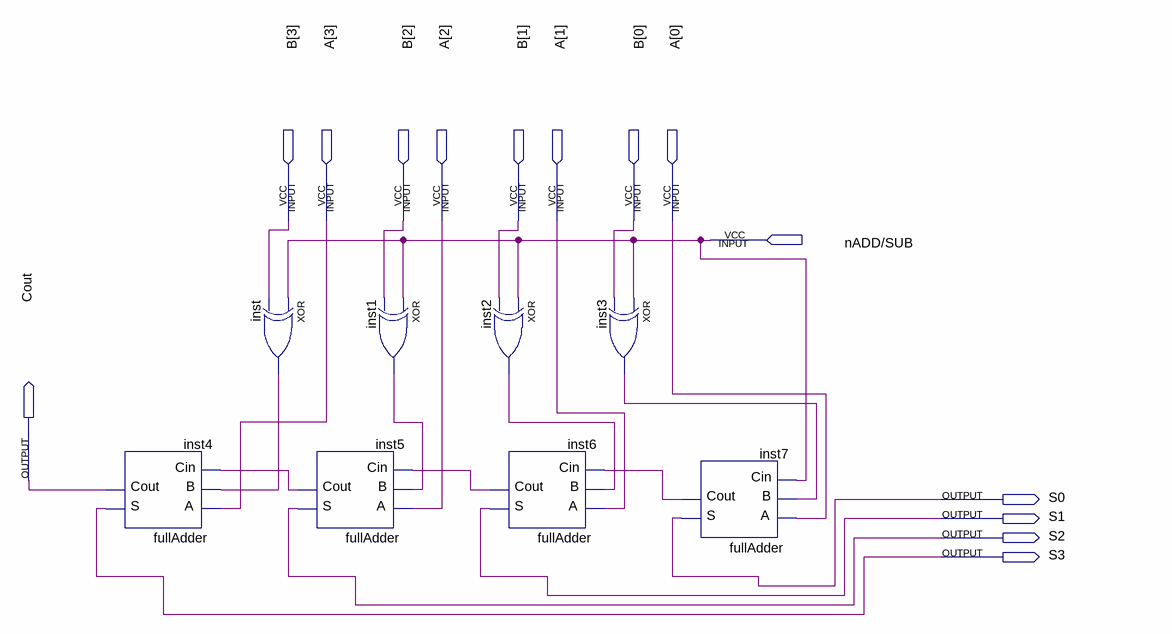
[diagram p0: schematic sheet]
// Quartus schematic SomadorSubtrator.bdf as structural Verilog: 8 symbols, 14 pins
module SomadorSubtrator (
  input  [3:0] B,
  input  [3:0] A,
  input  \nADD/SUB ,
  output Cout,
  output S0,
  output S1,
  output S2,
  output S3
);

  wire inst1_out, inst2_out, inst3_out, inst5_cout, inst6_cout, inst7_cout, inst_out;

  fullAdder inst4 (.A(A[3]), .B(inst_out), .Cin(inst5_cout), .S(S3), .Cout(Cout));
  xor inst (inst_out, \nADD/SUB , B[3]);
  fullAdder inst5 (.A(A[2]), .B(inst1_out), .Cin(inst6_cout), .S(S2), .Cout(inst5_cout));
  xor inst1 (inst1_out, \nADD/SUB , B[2]);
  xor inst2 (inst2_out, \nADD/SUB , B[1]);
  fullAdder inst6 (.A(A[1]), .B(inst2_out), .Cin(inst7_cout), .S(S1), .Cout(inst6_cout));
  xor inst3 (inst3_out, \nADD/SUB , B[0]);
  fullAdder inst7 (.A(A[0]), .B(inst3_out), .Cin(\nADD/SUB ), .S(S0), .Cout(inst7_cout));
endmodule
